# EAGLE design usb_power (EAGLE 9.4.0)
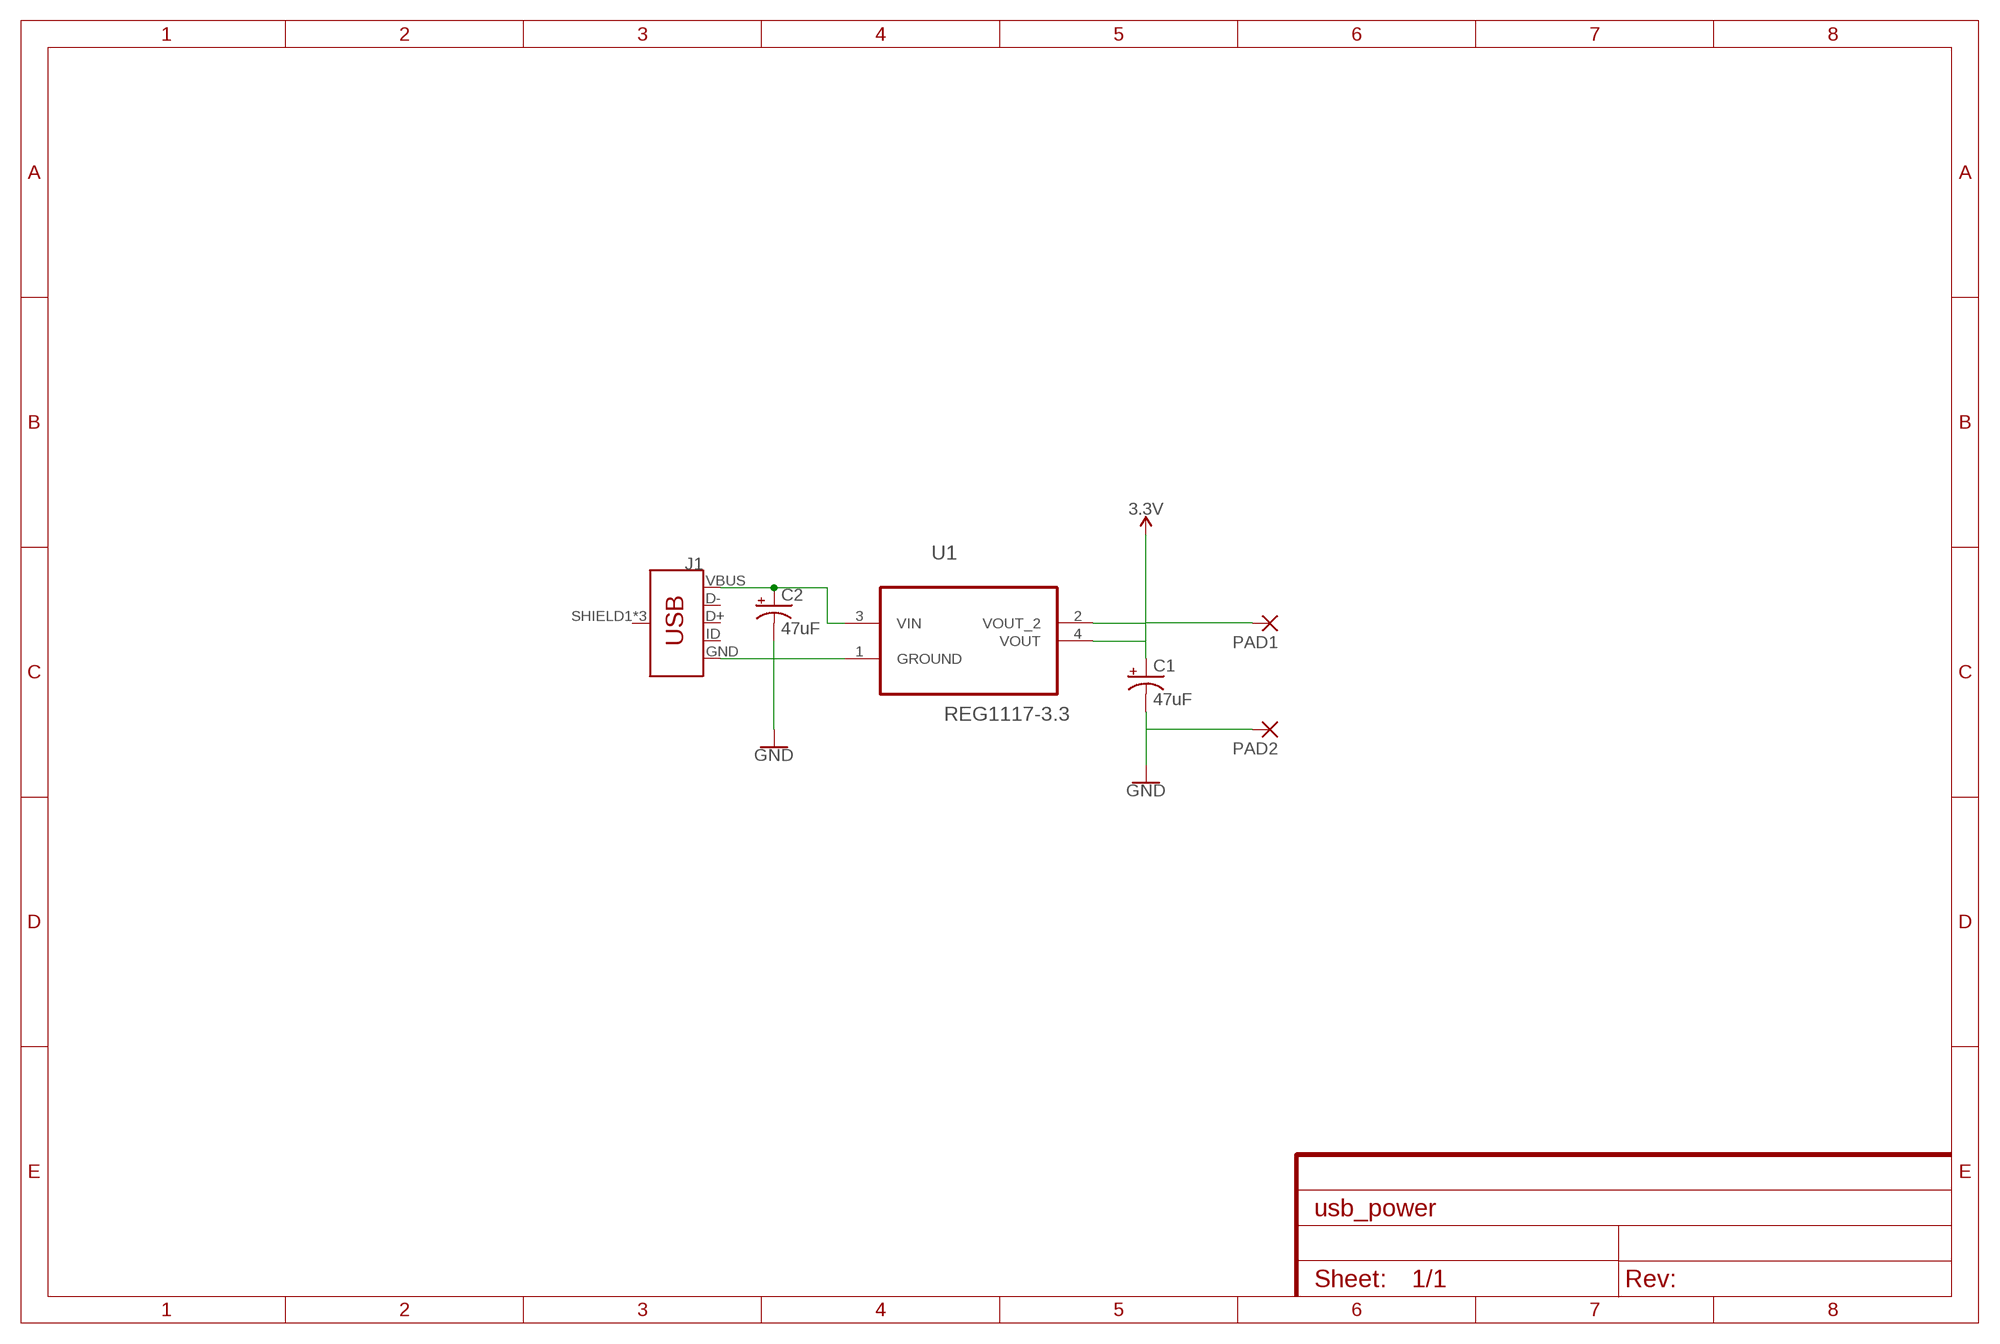
[diagram p0: schematic, sheet 1]

## Parts
C1  47uF  47UF-POLAR-EIA3528-10V-10%  [EIA3528]
C2  47uF  47UF-POLAR-EIA3528-10V-10%  [EIA3528]
J1  USB_MICRO-B_FEMALE-SMT  [USB-B-MICRO-SMD]
PAD1  SMD5  [SMD2,54-5,08]
PAD2  SMD5  [SMD2,54-5,08]
U1  REG1117-3.3  [SOT230P700X180-4N]

## Nets
3.3V: C1.A(+) PAD1.1(P) U1.2(VOUT_2) U1.4(VOUT)
GND: C1.C(-) C2.C(-) J1.GND PAD2.1(P) U1.1(GROUND)
N$1: C2.A(+) J1.VBUS U1.3(VIN)
Unconnected: J1.D+ J1.D- J1.ID J1.SHIELD1(SHIELD) J1.SHIELD2(SHIELD) J1.SHIELD3(SHIELD)

## Library data of the parts
C1 C2 = SparkFun-Capacitors:47UF-POLAR: 47µF polarized capacitors A capacitor is a passive two-terminal electrical component used to store electrical energy temporarily in an electric field.; PROD_ID: CAP-08310
J1 = SparkFun-Connectors:USB_MICRO-B: USB Type Micro-B Connector Male/female and PTH/SMT variants SparkFun Products: SparkFun microB USB Breakout <https://www.sparkfun.com/products/12035> SparkFun USB microB Plug Breakout <https://www.sparkfun.com/products/10031> SparkFun ESP8266 Thing <https://www.sparkfun.com/products/13231>; PROD_ID: CONN-11752
PAD1 PAD2 = wirepad:SMD5: SMD PAD
U1 = Texas Instruments_By_element14_Batch_1:REG1117-3.3: Low Dropout Positive Regulator; MPN: REG1117-3.3; OC_FARNELL: 1212355; OC_NEWARK: 35C1963; PACKAGE: SOT-223-4; SUPPLIER: Texas Instruments

## Board
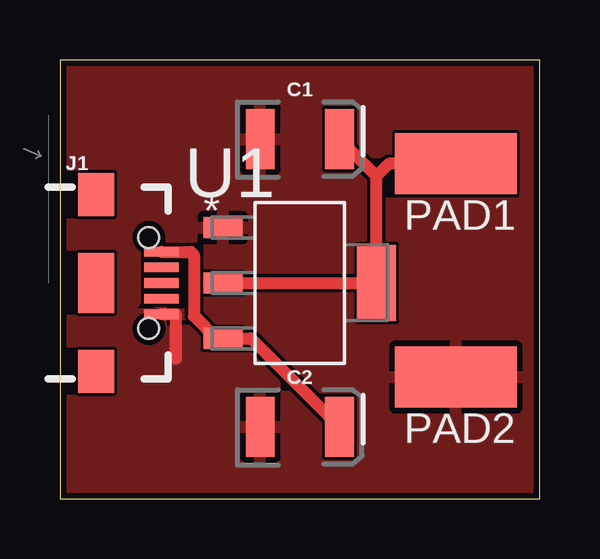
[diagram p1: board, top side]

Size 20 x 18.3 mm. Coordinates in mm from the lower left corner, seen from the top.
Outline: 0,0 20,0 20,18.3 0,18.3 0,0
Copper layers (1*16): Top 0.035mm / dielectric 1.5mm / Bottom 0.035mm
Design rules "dirtypcbs": minimum track width 5mil, minimum drill 12mil, track to track 5mil, track to pad 5mil, pad to pad 5mil, via to via 5mil, smd to smd 0mil, copper to edge 10mil, drill to drill 10mil, minimum pad ring 10mil, minimum via ring 6mil, stop-mask expansion 2mil, vias tented up to drill 25mil, thermal gap 10mil

### Footprints (pad centres in the part's own frame; a part is rotated, then mirrored left to right if it is on the bottom)
EIA3528 = smd 1.2 x 2.5: A 1.65,0; C -1.65,0
USB-B-MICRO-SMD = smd 1.45 x 0.4: D+ 2.725,0; D- 2.725,0.65; GND 2.725,-1.3; ID 2.725,-0.65; VBUS 2.725,1.3 | smd 1.5 x 1.8: SHIELD1 0,3.685; SHIELD2 0,-3.685 | smd 1.5 x 2.5: SHIELD3 0,0 | hole 0.85: 2.2,1.9; 2.2,-1.9
SMD2,54-5,08 = smd 2.54 x 5.08: 1 0,0
SOT230P700X180-4N = smd 1.626 x 0.889: 1 -3.2,2.311; 2 -3.2,0; 3 -3.2,-2.311 | smd 1.626 x 3.175: 4 3.2,0

### Placement (x,y rotation side)
C1  10,15 0 top
C2  10,3 0 top
J1  1.5,9 0 top
PAD1  16.51,13.97 90 top
PAD2  16.51,5.08 90 top
U1  10,9 0 top

### Tracks (layer width: path | path; a pad name or v marks a point on that pad's centre or on a via)
3.3V
  Top 0.508: 13.2,13.45 U1.4 U1.2 | 13.2,13.45 C1.A | PAD1.1 13.72,13.97 13.2,13.45
GND
  Top 0.508: J1.GND 4.83,7.7 4.83,5.84
  pour Top: -2.29,21.08 23.37,21.08 23.37,-3.05 -2.54,-3.05 -2.54,21.08
N$1
  Top 0.508: C2.A 7.96,6.69 U1.3 6.52,6.69 5.59,7.62 5.59,10.16 5.45,10.3 J1.VBUS